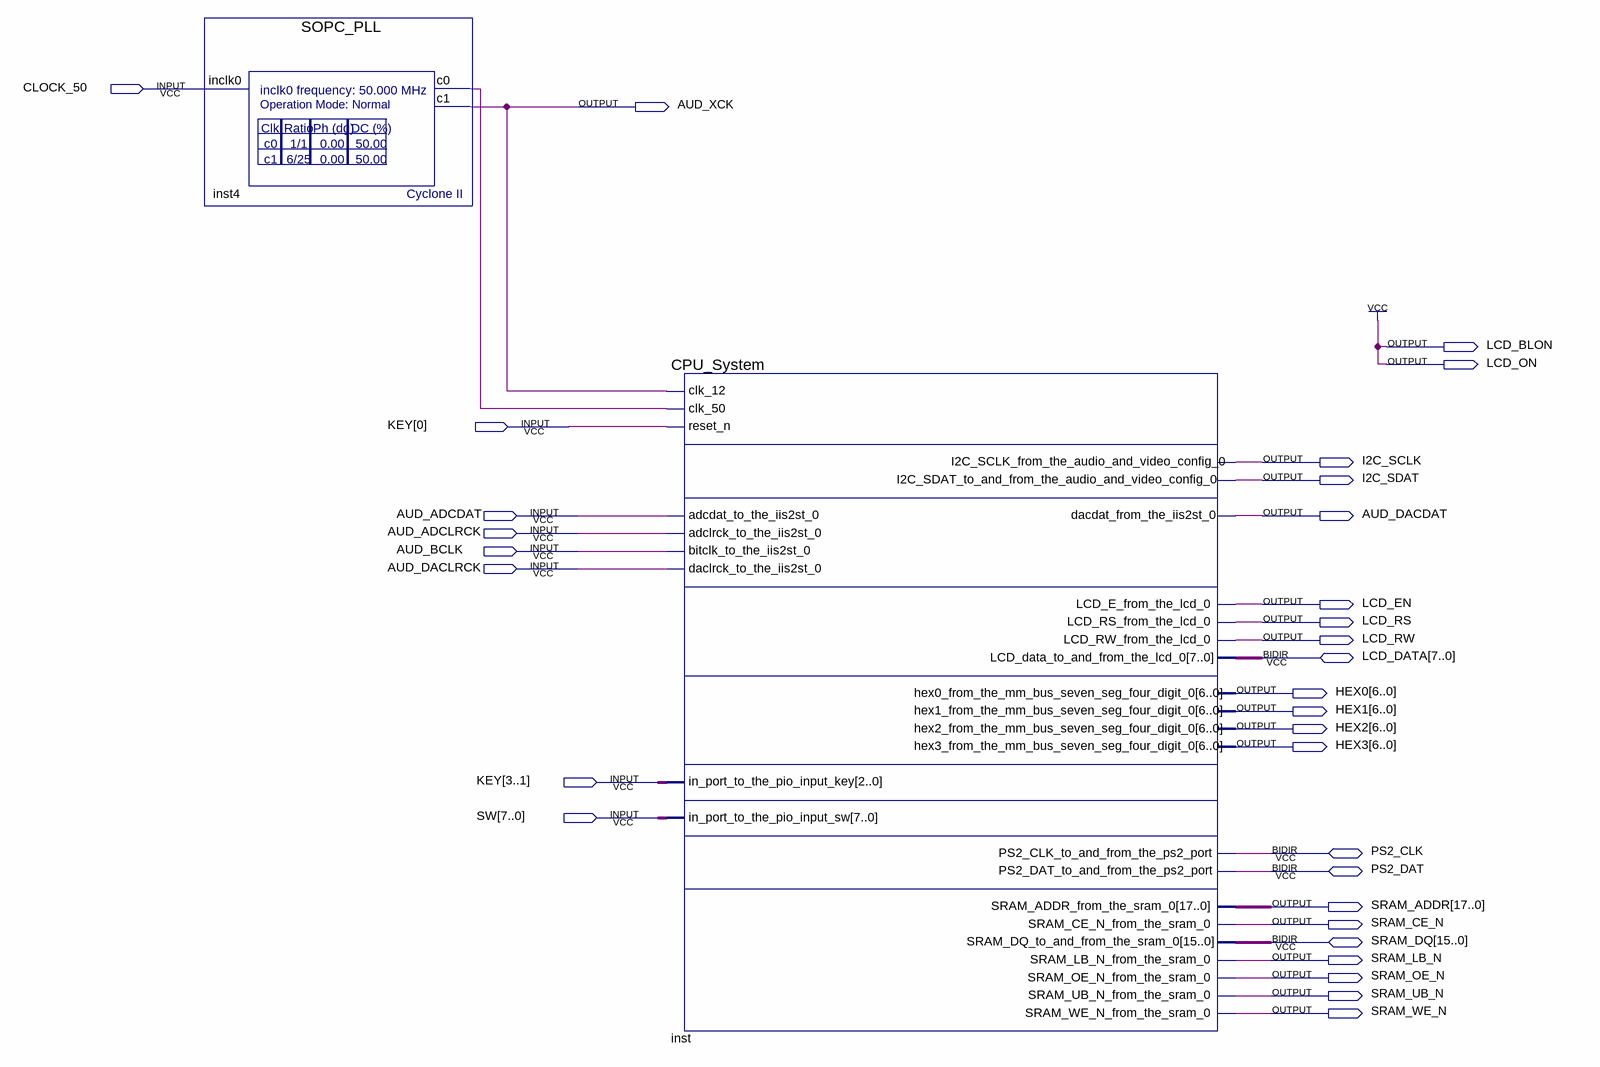
[diagram p0: schematic sheet]
// Quartus schematic KeyboardSound.bdf as structural Verilog: 2 symbols, 31 pins
module KeyboardSound (
  input  CLOCK_50,
  input  [3:0] KEY,
  input  AUD_ADCDAT,
  input  AUD_ADCLRCK,
  input  AUD_BCLK,
  input  AUD_DACLRCK,
  input  [7:0] SW,
  inout  [7:0] LCD_DATA,
  inout  PS2_CLK,
  inout  PS2_DAT,
  inout  [15:0] SRAM_DQ,
  output AUD_XCK,
  output LCD_BLON,
  output LCD_ON,
  output I2C_SCLK,
  output I2C_SDAT,
  output AUD_DACDAT,
  output LCD_EN,
  output LCD_RS,
  output LCD_RW,
  output [6:0] HEX0,
  output [6:0] HEX1,
  output [6:0] HEX2,
  output [6:0] HEX3,
  output [17:0] SRAM_ADDR,
  output SRAM_CE_N,
  output SRAM_LB_N,
  output SRAM_OE_N,
  output SRAM_UB_N,
  output SRAM_WE_N
);

  wire inst4_c0;

  SOPC_PLL inst4 (.inclk0(CLOCK_50), .c0(inst4_c0), .c1(AUD_XCK));
  CPU_System inst (
    .clk_12(AUD_XCK), .clk_50(inst4_c0), .reset_n(KEY[0]), .adcdat_to_the_iis2st_0(AUD_ADCDAT),
    .adclrck_to_the_iis2st_0(AUD_ADCLRCK), .bitclk_to_the_iis2st_0(AUD_BCLK),
    .daclrck_to_the_iis2st_0(AUD_DACLRCK), .in_port_to_the_pio_input_key(KEY[3:1]),
    .in_port_to_the_pio_input_sw(SW), .I2C_SCLK_from_the_audio_and_video_config_0(I2C_SCLK),
    .dacdat_from_the_iis2st_0(AUD_DACDAT), .LCD_E_from_the_lcd_0(LCD_EN), .LCD_RS_from_the_lcd_0(LCD_RS),
    .LCD_RW_from_the_lcd_0(LCD_RW), .hex0_from_the_mm_bus_seven_seg_four_digit_0(HEX0),
    .hex1_from_the_mm_bus_seven_seg_four_digit_0(HEX1), .hex2_from_the_mm_bus_seven_seg_four_digit_0(HEX2),
    .hex3_from_the_mm_bus_seven_seg_four_digit_0(HEX3), .SRAM_ADDR_from_the_sram_0(SRAM_ADDR),
    .SRAM_CE_N_from_the_sram_0(SRAM_CE_N), .SRAM_LB_N_from_the_sram_0(SRAM_LB_N),
    .SRAM_OE_N_from_the_sram_0(SRAM_OE_N), .SRAM_UB_N_from_the_sram_0(SRAM_UB_N),
    .SRAM_WE_N_from_the_sram_0(SRAM_WE_N), .I2C_SDAT_to_and_from_the_audio_and_video_config_0(I2C_SDAT),
    .LCD_data_to_and_from_the_lcd_0(LCD_DATA), .PS2_CLK_to_and_from_the_ps2_port(PS2_CLK),
    .PS2_DAT_to_and_from_the_ps2_port(PS2_DAT), .SRAM_DQ_to_and_from_the_sram_0(SRAM_DQ));

  assign LCD_BLON = 1'b1;
  assign LCD_ON = 1'b1;
endmodule
